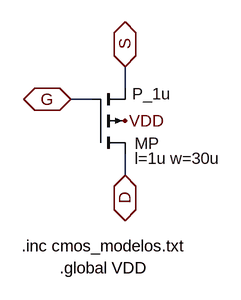
[diagram p0: schematic PMOSX.asc]
PMOSX.asc, the LTspice schematic file:
Version 4
SHEET 1 2472 680
WIRE -912 -240 -912 -272
WIRE -960 -224 -992 -224
WIRE -912 -112 -912 -144
FLAG -992 -224 G
IOPIN -992 -224 BiDir
FLAG -912 -272 S
IOPIN -912 -272 BiDir
FLAG -912 -112 D
IOPIN -912 -112 BiDir
FLAG -912 -192 VDD
SYMBOL pmos4 -960 -144 M180
WINDOW 0 62 15 Left 2
WINDOW 3 59 88 Left 2
WINDOW 123 62 -7 Left 2
SYMATTR InstName MP
SYMATTR Value P_1u
SYMATTR Value2 l=1u w=30u
TEXT -1064 -8 Left 2 !.inc cmos_modelos.txt
TEXT -1008 24 Left 2 !.global VDD

The netlist it stands for:
* PMOSX.asc
MP D G S VDD P_1u l=1u w=30u
.model NMOS NMOS
.model PMOS PMOS
.lib standard.mos
.inc cmos_modelos.txt
.global VDD
.backanno
.end